# EasyEDA Pro project ProPrj_BackupProjects_ysingh2026_personal_0_20260314_2026-04-07.epro

# Schematic Bone conduction headphones
Board Name: Bone conduction headphones; Create Date: 2026-03-14; Page Name: Sheet_1; Project Name: BackupProjects_ysingh2026_personal_0_20260314; Schematic Name: Bone conduction headphones; Update Date: 2026-03-30; Add into BOM: yes; Company: Your Company; Convert to PCB: yes; Date: 2026-03-11; Draw By: ysingh2026; REV: 1.0; Sheet: 1/1; spicePre: .
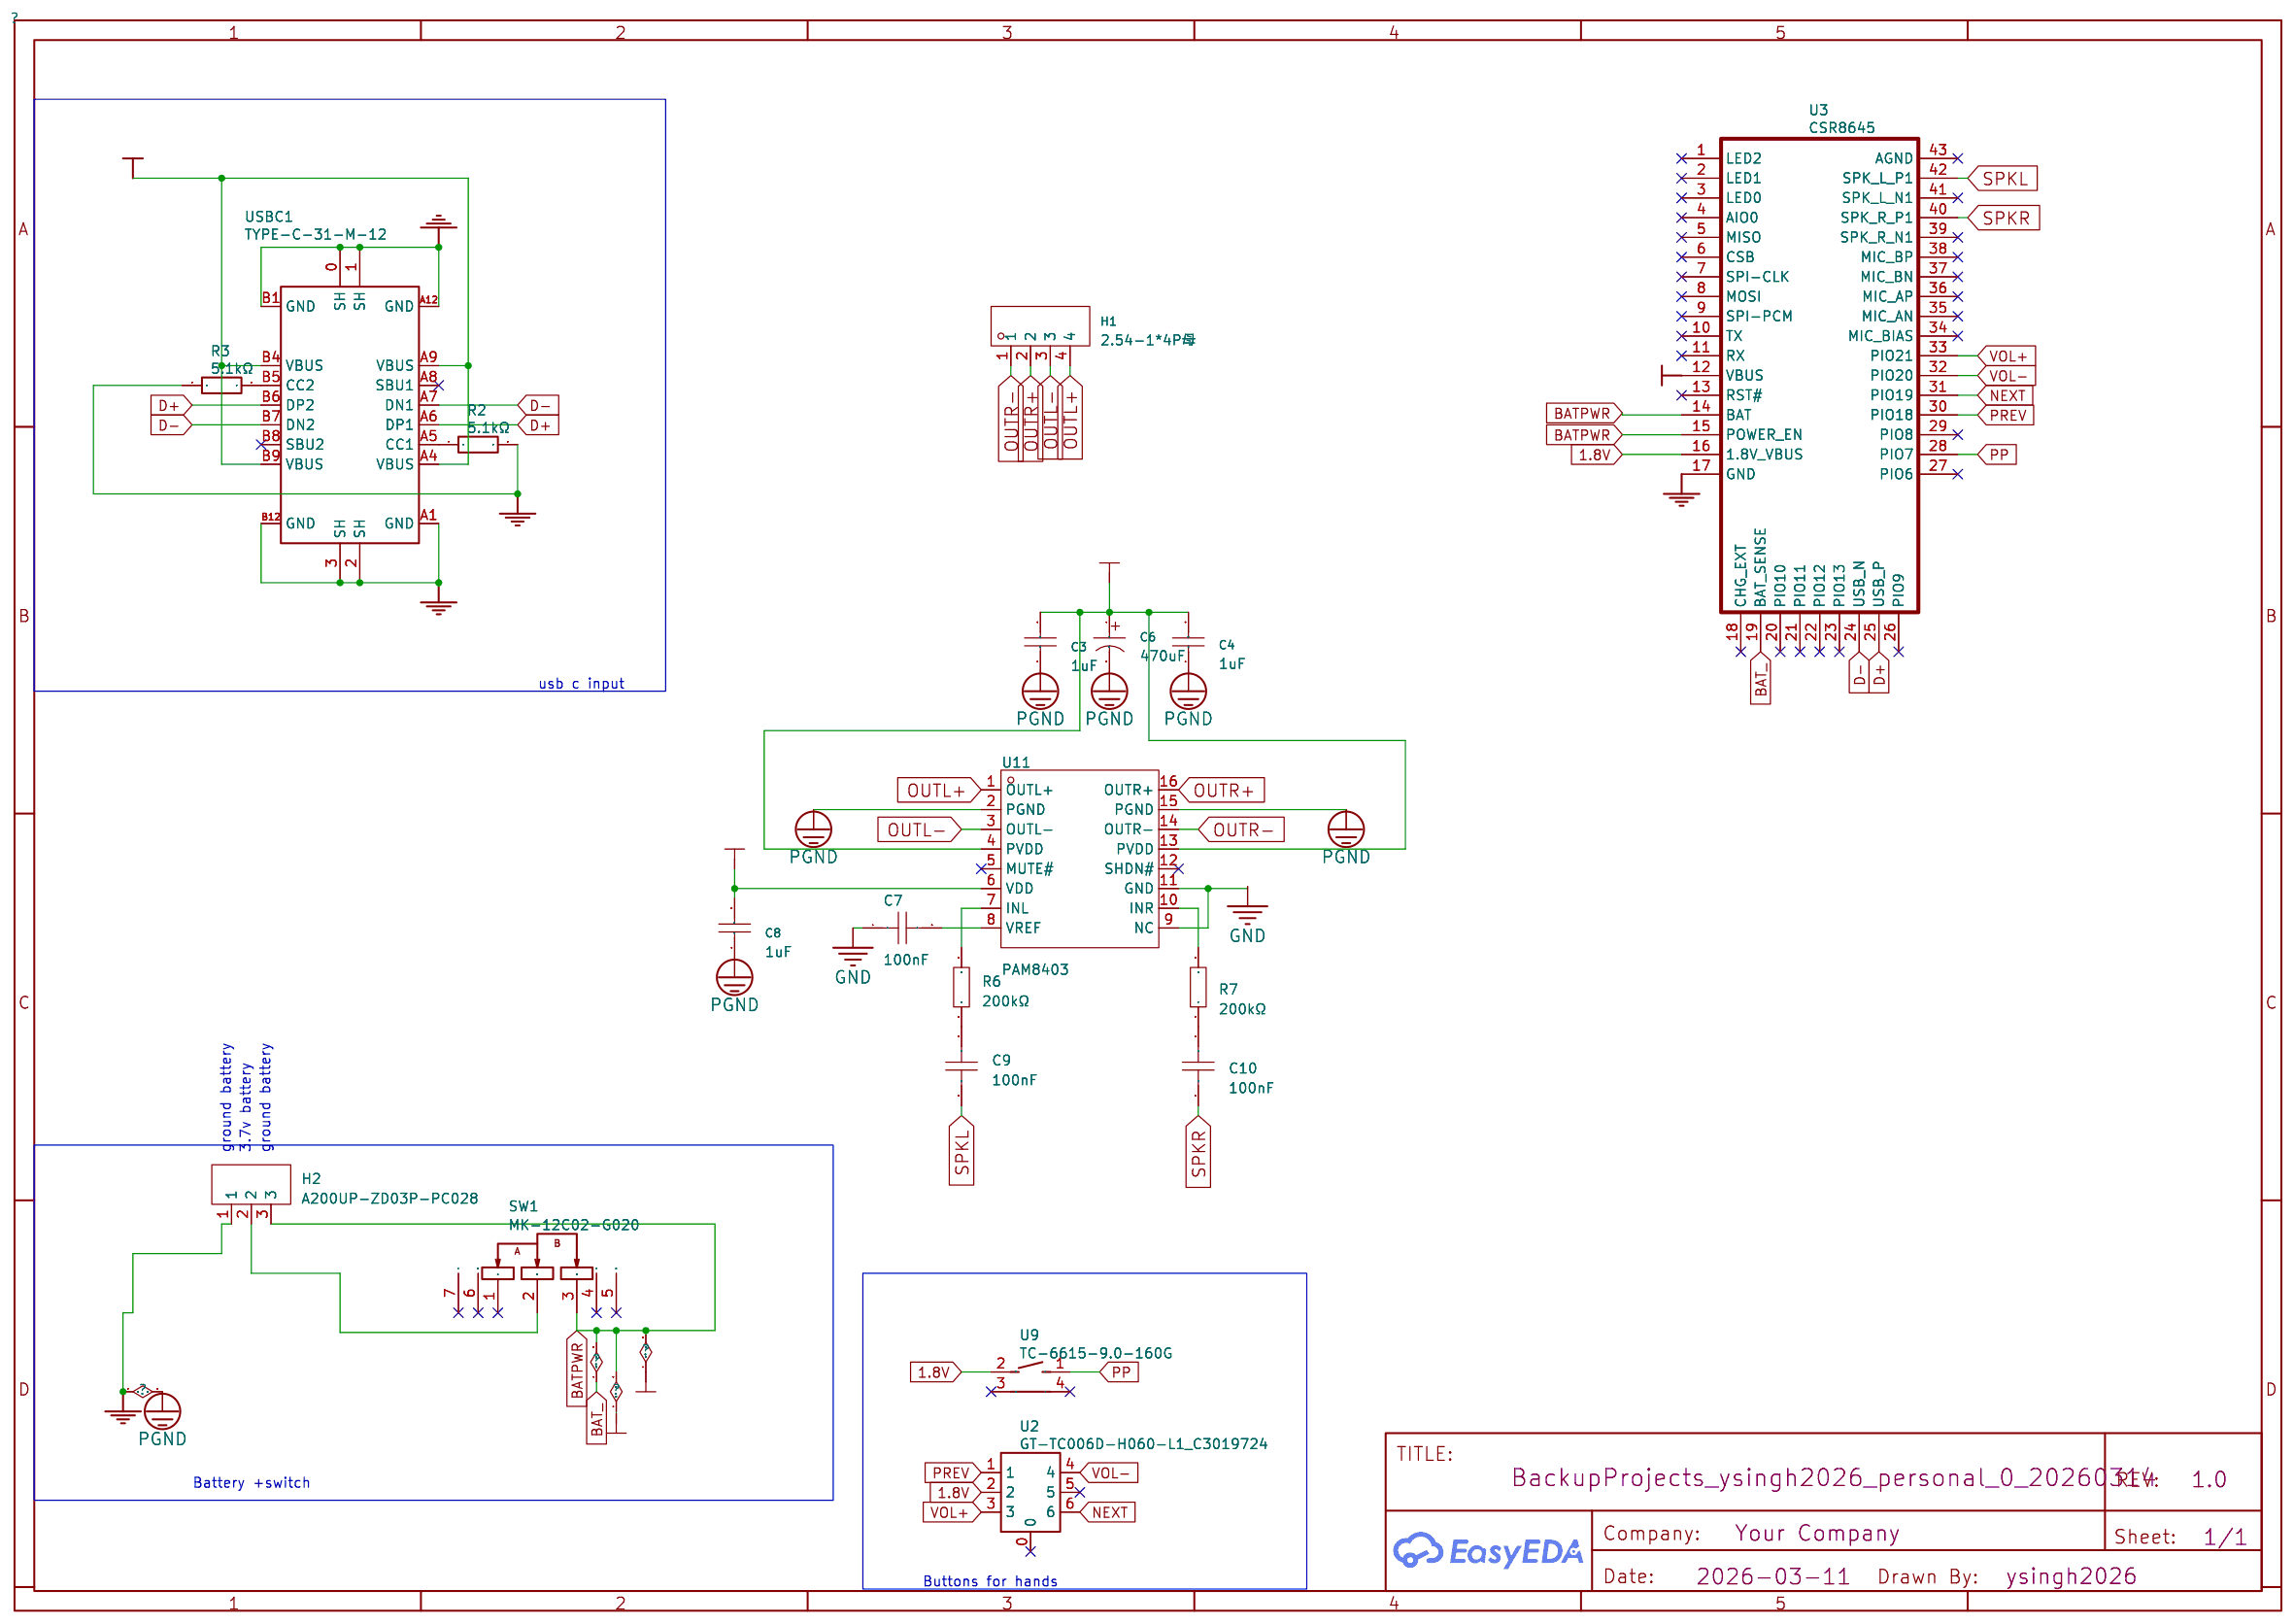
[diagram p0: schematic sheet]

## Parts
C3  1uF  [C0805]
C4  1uF  [C0805]
C6  470uF  [CAP-TH_BD10.0-P5.00-D1.0-FD]
C7  100nF  [C0603]
C8  1uF  [C0805]
C9  100nF  [C0603]
C10  100nF  [C0603]
H1  2.54-1*4P母  [HDR-TH_4P-P2.54-V-F]
H2  A200UP-ZD03P-PC028  [HDR-TH_A200UP-ZD03P-PC028]
R2  5.1kΩ  [R0402]
R3  5.1kΩ  [R0402]
R6  200kΩ  [R0603]
R7  200kΩ  [R0603]
SW1  MK-12C02-G020  [SW-SMD_MK-12C02-G020]
U2  GT-TC006D-H060-L1_C3019724  [SW-SMD-8_L7.5-W7.5-P1.40_GT-TC006D-H060-L1]
U3  CSR8645  [CSR8645]
U9  TC-6615-9.0-160G  [KEY-TH_PTS645VXX83XLFS]
U11  PAM8403  [SOP-16_L10.0-W3.9-P1.27-LS6.0-BL]
USBC1  TYPE-C-31-M-12  [USB-C_SMD-TYPE-C-31-M-12]

## Library data of the parts
C3 C4 C8 = CL21B105KBFNNNE: Capacitance:1uF Tolerance:±10% Tolerance:±10% Voltage Rating:50V Temperature Coefficient:X7R; LCSC Part Name: 1uF ±10% 50V; Supplier Part: C28323; Manufacturer: SAMSUNG(三星); Supplier Footprint: 0805; JLCPCB Part Class: Basic Part; Datasheet: https://item.szlcsc.com/datasheet/CL21B105KBFNNNE/29074.html; Supplier: LCSC; Tolerance: ±10%; Voltage Rating: 50V; Temperature Coefficient: X7R
C6 = 35YXJ470M10x16: Capacitance: Tolerance:±20% Tolerance:±20% Rated Voltage: Lead Spacing: φD: L: Lifetime @ Temp:10000hrs@105℃; LCSC Part Name: 470uF ±20% 35V; Supplier Part: C88732; Manufacturer: rubycon(红宝石); Supplier Footprint: 插件,D10xL16mm; JLCPCB Part Class: Extended Part; Datasheet: https://atta.szlcsc.com/upload/public/pdf/source/20190927/C432444_D90212164DBC1B856ABE912664018FD4.pdf; Supplier: LCSC; Tolerance: ±20%; Lifetime @ Temp: 10000hrs@105℃
C7 C9 C10 = CC0603KRX7R9BB104: Capacitance:100nF Tolerance:±10% Tolerance:±10% Voltage Rating:50V Temperature Coefficient:X7R; LCSC Part Name: 100nF ±10% 50V; Supplier Part: C14663; Manufacturer: YAGEO(国巨); Supplier Footprint: 0603; JLCPCB Part Class: Basic Part; Datasheet: https://item.szlcsc.com/datasheet/CC0603KRX7R9BB104/15331.html; Supplier: LCSC; Tolerance: ±10%; Voltage Rating: 50V; Temperature Coefficient: X7R
H1 = 2.54-1*4P母: Holes Structure:1x4P Pitch:2.54mm Row Spacing:- Circular Hole / Square Hole:Square Hole Mounting Type:Through Hole Number of Rows:1 Number of Positions:4P Current Rating:3A Voltage Rating (Max):- Holes Direction:Top Insulation Height:- Contact Material:Br; LCSC Part Name: 间距:2.54mm 1x4P 直插; Supplier Part: C2718488; Manufacturer: BOOMELE(博穆精密); Supplier Footprint: 插件,P=2.54mm; JLCPCB Part Class: Extended Part; Datasheet: https://item.szlcsc.com/datasheet/2.54-1*4P%25E6%25AF%258D/2834502.html; Supplier: LCSC; Holes Structure: 1x4P; Pitch: 2.54mm; Circular Hole / Square Hole: Square Hole; Mounting Type: Through Hole; Number of Rows: 1; Number of Positions: 4P; Current Rating: 3A; Holes Direction: Top; Contact Material: Bronze; Operating Temperature: -40℃~+105℃
H2 = A200UP-ZD03P-PC028: Pin Structure:1x3P Pitch:2mm Circluar Pins/Square Pins:Pin Header Mounting Type:Through Hole Number of Rows:1 Number of Pins:3P Current Rating:1.5A Length of Mating Pin:3.9mm Insulation Height:2mm Length of End Connection Pin:2.8mm Contact Material:Copper; LCSC Part Name: 1x3P 间距:2mm 方针 直插; Supplier Part: C49563331; Manufacturer: BXCONN(宝讯); Supplier Footprint: 插件,P=2mm; JLCPCB Part Class: Extended Part; Datasheet: https://item.szlcsc.com/datasheet/A200UP-ZD03P-PC028/52117272.html; Supplier: LCSC; Pin Structure: 1x3P; Pitch: 2mm; Circluar Pins/Square Pins: Pin Header; Mounting Type: Through Hole; Number of Rows: 1; Number of Pins: 3P; Current Rating: 1.5A; Length of Mating Pin: 3.9mm; Insulation Height: 2mm; Length of End Connection Pin: 2.8mm; Contact Material: Copper alloy; Operating Temperature: -40℃~+105℃
R2 R3 = 5.1kΩ: Supplier: LCSC; Manufacturer: YAGEO(国巨); Manufacturer Part: RC0402FR-075K1L; Supplier Part: C105872; JLCPCB Part Class: Extended Part; nameAlias: Value; spicePre: R; spiceSymbolName: RC0402FR-075K1L
R6 R7 = RC0603FR-07200KL: Type:Thick Film Resistors Resistance: Tolerance:±1% Tolerance:±1% Power(Watts): Overload Voltage (Max): Temperature Coefficient:±100ppm/℃ Temperature Coefficient:±100ppm/℃ Operating Temperature Range:-55℃~+155℃ Operating Temperature Range:-55℃~+155℃; LCSC Part Name: 厚膜电阻 200kΩ ±1% 100mW; Supplier Part: C105574; Manufacturer: YAGEO(国巨); Supplier Footprint: 0603; JLCPCB Part Class: Extended Part; Datasheet: https://atta.szlcsc.com/upload/public/pdf/source/20180821/C275644_0D56F95EFF785E7D9A1FEF436B37DA78.pdf; Supplier: LCSC; Type: Thick Film Resistors; Tolerance: ±1%; Temperature Coefficient: ±100ppm/℃; Operating Temperature Range: -55℃~+155℃
SW1 = MK-12C02-G020: Supplier: LCSC; Supplier Part: C963206; Manufacturer: G-Switch(品赞); JLCPCB Part Class: Extended Part; Contributor: LCSC; spicePre: S
U2 = GT-TC006D-H060-L1_C3019724: Supplier: LCSC; Supplier Part: C3019724; Manufacturer: G-Switch(品赞); Manufacturer Part: GT-TC006D-H060-L1; JLCPCB Part Class: Extended Part; Contributor: lcsc; spicePre: U
U3 = CSR8645: Supplier: EasyEDA; Contributor: kingcake; spicePre: U
U9 = TC-6615-9.0-160G: Supplier: LCSC; Supplier Part: C6575016; Manufacturer: HCTL(华灿天禄); JLCPCB Part Class: Extended Part; Contributor: lcsc; spicePre: U
U11 = PAM8403: Class:Class D Speaker Channels:2-Channel Output Power:3Wx2@4Ω Voltage - Supply:2.2V~5.5V Voltage - Supply:2.2V~5.5V Quiescent Current:6.3mA Operating Temperature:-40℃~+85℃ Operating Temperature:-40℃~+85℃ Efficiency:90%; LCSC Part Name: 3W无滤波器D类立体声音频功分器; Supplier Part: C5122557; Manufacturer: Slkor(萨科微); Supplier Footprint: SOP-16; JLCPCB Part Class: Extended Part; Datasheet: https://item.szlcsc.com/datasheet/PAM8403/5713463.html; Supplier: LCSC; Class: Class D; Speaker Channels: 2-Channel; Output Power: 3Wx2@4Ω; Voltage - Supply: 2.2V~5.5V; Quiescent Current: 6.3mA; Operating Temperature: -40℃~+85℃; Efficiency: 90%
USBC1 = TYPE-C-31-M-12: Supplier: LCSC; Supplier Part: C165948; Manufacturer: 韩国韩荣; JLCPCB Part Class: Extended Part; Contributor: LCSC; spicePre: U

## Nets
1.8V: U2.2 U3.16(1.8V VBUS) U9.2
+5V: U3.12(VBUS) USBC1.A4(VBUS) USBC1.A9(VBUS) USBC1.B4(VBUS) USBC1.B9(VBUS)
GND: C3.1 C4.1 C6.2 C7.1 C8.1 H2.1 R2.2 R3.1 U3.17(GND) U11.2(PGND) U11.9(NC) U11.11(GND) U11.15(PGND) USBC1.0(SH) USBC1.1(SH) USBC1.2(SH) USBC1.3(SH) USBC1.A1(GND) USBC1.A12(GND) USBC1.B1(GND) USBC1.B12(GND)
PVDD: C3.2 C4.2 C6.1 C8.2 H2.3 SW1.3 U3.14(BAT) U3.15(POWER_EN) U3.19(BAT_SENSE) U11.4(PVDD) U11.6(VDD) U11.13(PVDD)
D+: U3.25(USB_P) USBC1.A6(DP1) USBC1.B6(DP2)
D-: U3.24(USB_N) USBC1.A7(DN1) USBC1.B7(DN2)
NEXT: U2.6 U3.31(PIO19)
OUTL+: H1.4 U11.1(OUTL+)
OUTL-: H1.3 U11.3(OUTL-)
OUTR+: H1.2 U11.16(OUTR+)
OUTR-: H1.1 U11.14(OUTR-)
PP: U3.28(PIO7) U9.1
PREV: U2.1 U3.30(PIO18)
SPKL: C9.1 U3.42(SPK_L_P1)
SPKR: C10.1 U3.40(SPK_R_P1)
VOL+: U2.3 U3.33(PIO21)
VOL-: U2.4 U3.32(PIO20)
$1N1: H2.2 SW1.2
$1N416: R3.2 USBC1.B5(CC2)
$1N417: R2.1 USBC1.A5(CC1)
$1N3990: C7.2 U11.8(VREF)
$1N4311: C9.2 R6.1
$1N4313: C10.2 R7.1
$1N4317: R6.2 U11.7(INL)
$1N4322: R7.2 U11.10(INR)

Not connected (* = marked no-connect by the designer): SW1 1* 4* 5* 6* 7*; U2 0* 5*; U3 1(LED2)* 2(LED1)* 3(LED0)* 4(AIO0)* 5(MISO)* 6(CSB)* 7(SPI-CLK)* 8(MOSI)* 9(SPI-PCM)* 10(TX)* 11(RX)* 13(RST#)* 18(CHG_EXT)* 20(PIO10)* 21(PIO11)* 22(PIO12)* 23(PIO13)* 26(PIO9)* 27(PIO6)* 29(PIO8)* 34(MIC_BIAS)* 35(MIC_AN)* 36(MIC_AP)* 37(MIC_BN)* 38(MIC_BP)* 39(SPK_R_N1)* 41(SPK_L_N1)* 43(AGND)*; U9 3* 4*; U11 5(MUTE#)* 12(SHDN#)*; USBC1 A8(SBU1)* B8(SBU2)*

## Notes on the sheet
- usb c input
- ground battery
- 3.7v battery
- ground battery
- Battery +switch
- Buttons for hands

# Board 1-PCB_PCB_Bone conduction headphones_2
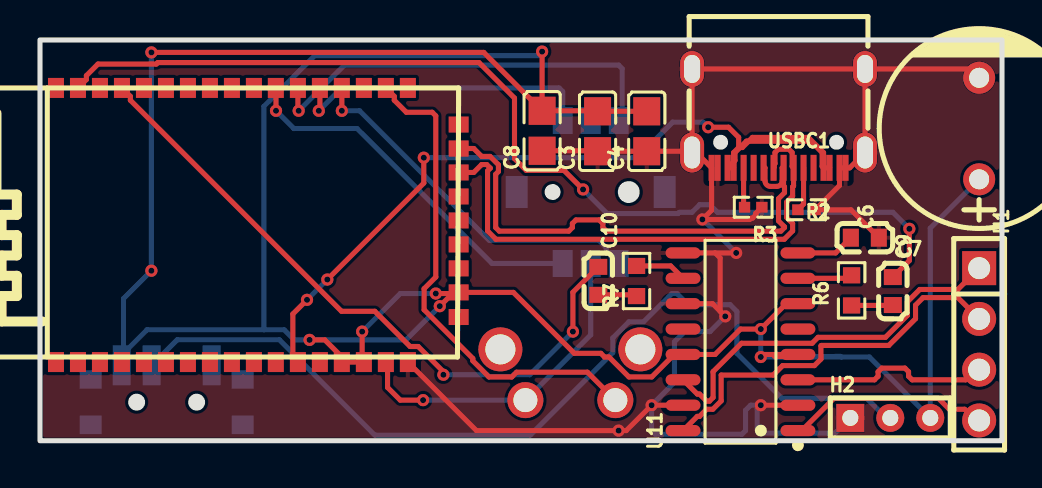
[diagram p1: board, top side]
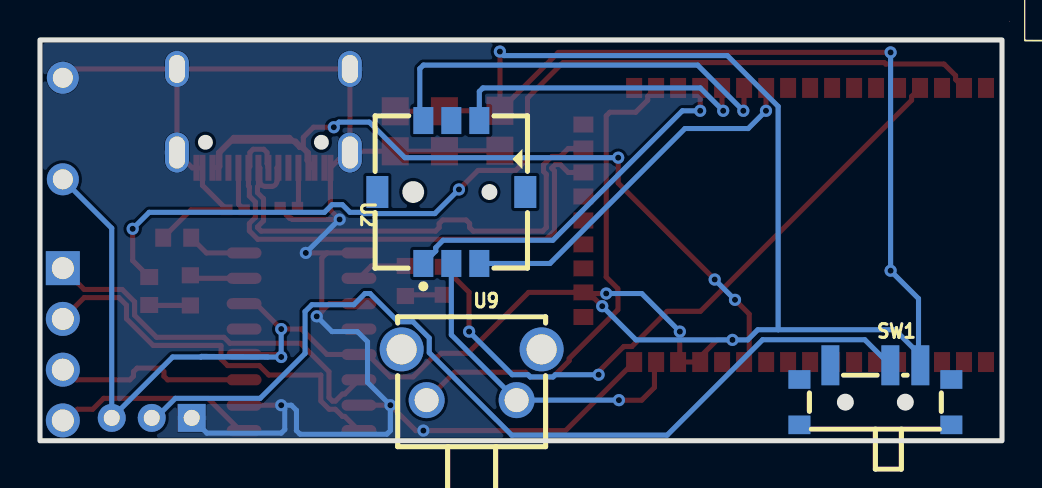
[diagram p2: board, bottom side, seen from below]

Outline 48.12 x 20.05 mm; copper layers: Top Layer, Bottom Layer. Coordinates in mm from the lower left corner of the outline.
Outline path: rectangle 0,20.05 48.12,0
Stack: Top Layer 0.035mm / Dielectric1 1.51mm FR4 er 4.5 / Bottom Layer 0.035mm

## Design rules (mm)
net D-: DP1
net D+: DP1
net OUTR+: DP3
net OUTR-: DP3
net OUTL-: DP2
net OUTL+: DP2
spacing Default (default): track to track 0.152, other pairs 0 to 0.152
track width Default (default): min 0.254, default 0.254, max 25.4
differential pair differentialPair (default): width min 0.127, default 0.254, max 2.54; gap min 0.152, default 0.152
via Default (default): diameter min 0.61, default 0.61, max 100.025; hole min 0.305, default 0.305, max 59.995

## Placement (name value [footprint] x y rotation side)
C3  1uF  [C0805]  27.89 15.49 90 top
C4  1uF  [C0805]  30.35 15.49 90 top
C6  470uF  [CAP-TH_BD10.0-P5.00-D1.0-FD]  46.97 15.62 90 top
C7  100nF  [C0603]  41.26 10.16 180 top
C8  1uF  [C0805]  25.12 15.51 90 top
C9  100nF  [C0603]  42.66 7.49 270 top
C10  100nF  [C0603]  27.93 8 270 top
H1  2.54-1*4P母  [HDR-TH_4P-P2.54-V-F]  46.97 4.83 270 top
H2  A200UP-ZD03P-PC028  [HDR-TH_A200UP-ZD03P-PC028]  42.53 1.14 0 top
R2  5.1kΩ  [R0402]  38.34 11.56 0 top
R3  5.1kΩ  [R0402]  35.67 11.68 180 top
R6  200kΩ  [R0603]  40.59 7.52 90 top
R7  200kΩ  [R0603]  29.84 7.99 90 top
SW1  MK-12C02-G020  [SW-SMD_MK-12C02-G020]  6.34 2.29 180 bottom
U2  GT-TC006D-H060-L1_C3019724  [SW-SMD-8_L7.5-W7.5-P1.40_GT-TC006D-H060-L1]  27.54 12.45 90 bottom
U3  -  [CSR8645]  20.94 6.22 90 top
U9  TC-6615-9.0-160G  [KEY-TH_PTS645VXX83XLFS]  26.53 3.3 180 bottom
U11  PAM8403  [SOP-16_L10.0-W3.9-P1.27-LS6.0-BL]  35.04 4.95 90 top
USBC1  TYPE-C-31-M-12  [USB-C_SMD-TYPE-C-31-M-12]  36.94 16.13 180 top

## Footprints (pads in the part's own frame, mm; a bottom-side part is the same pattern mirrored in y, then rotated)
C0603
  rect 0.8x0.9 smd: 1(-0.7,0) 2(0.7,0)
C0805
  rect 1.41x1.35 smd: 1(-1,0) 2(1,0)
CAP-TH_BD10.0-P5.00-D1.0-FD
  round 1.6 hole 1: 1(-2.54,0) 2(2.54,0)
CSR8645
  rect 1x0.8 smd: 1(-2.285,20.14) 2(-2.285,19.04) 3(-2.285,17.94) 4(-2.285,16.84) 5(-2.285,15.74) 6(-2.285,14.64) 7(-2.285,13.54) 8(-2.285,12.44) 9(-2.285,11.34) 10(-2.285,10.24) 11(-2.285,9.144) 12(-2.285,8.04) 13(-2.285,6.94) 14(-2.285,5.842) 15(-2.285,4.74) 16(-2.285,3.64) 17(-2.285,2.54) 27(11.431,2.54) 28(11.431,3.64) 29(11.431,4.74) 30(11.431,5.842) 31(11.431,6.94) 32(11.431,8.04) 33(11.431,9.144) 34(11.431,10.24) 35(11.431,11.34) 36(11.431,12.44) 37(11.431,13.54) 38(11.431,14.64) 39(11.431,15.74) 40(11.431,16.84) 41(11.431,17.94) 42(11.431,19.04) 43(11.431,20.14)
  rect 0.8x1 smd: 18(-0.032,-0.001) 19(1.2,-0.001) 20(2.4,-0.001) 21(3.6,-0.001) 22(4.8,-0.001) 23(6,-0.001) 24(7.2,-0.001) 25(8.4,-0.001) 26(9.6,-0.001)
HDR-TH_4P-P2.54-V-F
  rect 1.7x1.7 hole 1.1: 1(-3.81,0)
  round 1.7 hole 1.1: 2(-1.27,0) 3(1.27,0) 4(3.81,0)
HDR-TH_A200UP-ZD03P-PC028
  rect 1.4x1.4 hole 0.8: 1(-2,0)
  round 1.4 hole 0.8: 2(0,0) 3(2,0)
KEY-TH_PTS645VXX83XLFS
  round 1.8 hole 1.2: 1(-2.25,-1.27) 2(2.25,-1.27)
  round 2.2 hole 1.5: 3(-3.5,1.27) 4(3.5,1.27)
R0402
  rect 0.566x0.54 smd: 1(-0.433,0) 2(0.433,0)
R0603
  rect 0.806x0.864 smd: 1(-0.753,0) 2(0.753,0)
SOP-16_L10.0-W3.9-P1.27-LS6.0-BL
  oval 0.56x1.745 smd: 1(-4.445,-2.873) 2(-3.175,-2.873) 3(-1.905,-2.873) 4(-0.635,-2.873) 5(0.635,-2.873) 6(1.905,-2.873) 7(3.175,-2.873) 8(4.445,-2.873) 9(4.445,2.873) 10(3.175,2.873) 11(1.905,2.873) 12(0.635,2.873) 13(-0.635,2.873) 14(-1.905,2.873) 15(-3.175,2.873) 16(-4.445,2.873)
SW-SMD-8_L7.5-W7.5-P1.40_GT-TC006D-H060-L1
  rect 1.6x1.1 smd: 0(0,-3.7) 0(0,3.7)
  rect 1.35x1 smd: 1(-3.575,1.4) 2(-3.575,0) 3(-3.575,-1.4) 4(3.575,1.4) 5(3.575,0) 6(3.575,-1.4)
SW-SMD_MK-12C02-G020
  rect 0.9x2 smd: 1(-2.25,1.49) 2(0.75,1.49) 3(2.25,1.49)
  rect 1.1x0.93 smd: 4(3.8,0.779) 5(3.8,-1.49) 6(-3.8,-1.49) 7(-3.8,0.779)
USB-C_SMD-TYPE-C-31-M-12
  oval 1.2x2 hole 0.8x1.6: 0(-4.325,1.706) 1(4.325,1.706)
  oval 1.2x1.8 hole 0.8x1.4: 2(4.325,-2.474) 3(-4.325,-2.474)
  rect 0.3x1.3 smd: A1(-3.35,2.474) A4(-2.55,2.474) A5(-1.25,2.474) A6(-0.25,2.474) A7(0.25,2.474) A8(1.25,2.474) A9(2.55,2.474) A12(3.35,2.474) B1(3.05,2.474) B4(2.25,2.474) B5(1.75,2.474) B6(0.75,2.474) B7(-0.75,2.474) B8(-1.75,2.474) B9(-2.25,2.474) B12(-3.05,2.474)

## Nets
As in the schematic.

Pads without a net: SW1 1 4 5 6 7; U2 0 5; U3 1 2 3 4 5 6 7 8 9 10 11 13 18 20 21 22 23 26 27 29 34 35 36 37 38 39 41 43; U9 3 4; U11 5 12; USBC1 A8 B8

## Via types
v1: diameter 0.61, hole 0.305, Top Layer to Bottom Layer, 28 vias

## Routing (per net, layer and track width the routed paths; a pad name or vN(x,y) marks a point on that pad's centre or on a via; arc(x,y) is an arc through that point)
1.8V: length 16.7
  Top Layer w0.254: U3.16 17.38,3.85 17.38,2.67 18.02,2.03 v1(19.16,2.03)
  Bottom Layer w0.254: 27.54,8.89 27.54,5.3 U9.2 v1(19.16,2.03)
+5V: length 44.2
  Top Layer w0.254: USBC1.B9 39.12,13.73 39.12,14.42 38.55,14.99 35.45,14.99 ; USBC1.B9 39.19,14.42 38.43,15.18 35.64,15.18 35.45,14.99 ; USBC1.B9 USBC1.A4 ; 35.01,14.67 35.33,14.99 35.45,14.99 ; 35.01,14.67 34.95,14.67 ; 35.01,14.67 35.13,14.67 35.45,14.99 ; 35.01,14.67 34.76,14.42 34.76,14.03 34.69,13.95 ; 34.69,13.95 USBC1.B4 USBC1.A9 34.69,13.95 ; 34.69,13.95 34.69,14.42 34.95,14.67 ; 34.95,14.67 34.95,15.18 34.44,15.69 v1(33.42,15.69) ; v1(14.37,8.07) 19.2,12.89 v1(19.2,14.16) ; U3.12 12.65,4.19 12.65,6.34 v1(13.36,7.05)
  Bottom Layer w0.254: v1(14.37,8.07) v1(13.36,7.05) ; v1(33.42,15.69) 33.17,15.94 31.64,15.94 29.87,14.16 v1(19.2,14.16)
GND: length 94.8
  Top Layer w0.254: C6.2 46.53,18.6 USBC1.3 ; R3.1 35.8,11.38 35.8,11.3 35.64,11.14 35.56,11.14 35.49,11.07 v1(33.13,11.07) 33.59,11.53 USBC1.A12 32.82,14.42 32.62,14.42 ; v1(34.82,9.4) 33.77,9.4 ; 33.77,9.4 34.02,9.14 34.02,6.48 ; 33.77,9.4 U11.9 ; USBC1.3 USBC1.0 40.5,13.66 USBC1.A1 USBC1.B12 39.99,12.78 R2.2 40.56,11.56 C7.1 ; USBC1.3 32.62,18.6 32.62,14.42 ; U3.17 21.83,0.51 v1(28.94,0.51) 29.32,0.51 v1(30.59,1.78) U11.15 ; 32.62,14.42 32.55,14.49 C4.1 C3.1 27.87,14.51 C8.1 ; U11.11 33.64,6.86 34.02,6.48 ; 34.02,6.48 v1(34.28,6.22) ; v1(36.05,1.78) U11.2
  Bottom Layer w0.254: v1(34.82,9.4) 33.15,11.07 v1(33.13,11.07) ; H2.1 39.77,0.38 36.05,0.38 35.87,0.56 35.87,1.6 v1(36.05,1.78) 35.54,1.78 35.29,1.52 35.29,0.51 35.11,0.33 30.77,0.33 30.59,0.51 v1(30.59,1.78) 31.74,2.92 31.74,4.95 32.24,5.46 33.51,5.46 v1(34.28,6.22)
PVDD: length 152.4
  Top Layer w0.254: v1(25.12,19.47) C8.2 ; C8.2 22.19,19.43 v1(5.57,19.43) ; C8.2 27.87,16.51 C3.2 C4.2 ; 36.74,4.22 37.81,4.22 U11.4 36.18,4.32 v1(36.05,4.19) ; 31.68,4.19 31.81,4.32 U11.13 ; 31.68,4.19 32.04,4.19 U11.13 ; 31.68,4.19 31.6,4.19 30.6,3.19 29.46,3.19 28.46,4.19 28.24,4.19 28.05,4.38 26.72,4.38 23.68,7.42 U3.19 ; v1(13.48,5.05) 14.25,5.05 15.01,4.28 15.01,4.03 U3.14 U3.15 16.11,4.02 v1(16.11,5.46) ; v1(20,6.73) 20.63,7.37 ; 20.63,7.37 20.88,7.37 U3.19 ; 20.63,7.37 v1(19.8,7.37) ; 20.63,7.37 20.69,7.42 U3.19 ; U11.13 33.77,4.32 35.04,5.59 v1(36.05,5.59) 37.32,6.86 U11.6
  Bottom Layer w0.254: 36.74,4.19 40.07,4.19 ; 36.74,4.19 v1(36.05,4.19) v1(36.05,5.59) ; 36.74,4.19 40.04,4.22 40.07,4.19 ; 40.07,4.19 41.48,4.19 H2.3 44.53,10.64 46.97,13.08 ; 4.18,4.38 4.09,4.28 SW1.3 4.18,3.87 4.18,4.38 ; 4.18,4.38 4.18,7.11 v1(5.57,8.51) v1(5.57,19.43) ; 4.18,4.38 5.35,5.55 11.2,5.55 ; v1(16.11,5.46) 18.02,7.37 v1(19.8,7.37) ; 11.2,5.55 11.2,16.73 13.74,19.27 24.91,19.27 v1(25.12,19.47) ; 11.2,5.55 12.21,5.55 12.72,5.05 v1(13.48,5.05) 18.31,5.05 v1(20,6.73)
D+: length 26.7
  Top Layer w0.254: USBC1.B6 36.26,13.66 36.26,13 arc(36.34,12.81) 36.54,12.73 36.84,12.73 arc(37.04,12.81) 37.12,13 37.12,13.66 USBC1.A6 37.19,12.75 37.24,12.7 37.24,12.41 36.94,12.11 36.94,11 37.24,10.7 37.24,10.67 37.06,10.49 28.33,10.49 28.15,10.67 28.15,10.87 27.97,11.05 26.81,11.05 26.63,10.87 26.63,10.67 26.45,10.49 22.97,10.49 22.79,10.67 22.79,13.33 22.93,13.47 22.93,13.81 22.51,14.23 22.09,14.23 21.69,14.62 U3.25
D-: length 26.6
  Top Layer w0.254: USBC1.A7 36.71,13.68 36.71,13.82 36.76,13.87 36.76,14.42 36.93,14.58 37.46,14.58 37.62,14.42 37.62,13.73 USBC1.B7 37.69,12.75 37.65,12.7 37.65,12.24 37.34,11.94 37.34,11.17 37.65,10.87 37.65,10.5 37.23,10.08 22.8,10.08 22.39,10.5 22.39,13.5 22.52,13.64 22.34,13.82 22.09,13.82 21.69,13.42 U3.24
NEXT: length 15.4
  Top Layer w0.254: v1(13.95,16.51) 14,16.56 U3.31
  Bottom Layer w0.254: v1(13.95,16.51) 15.09,17.65 25.96,17.65 26.14,17.47 U2.6
OUTL+: length 10.2
  Top Layer w0.254: H1.4 46.81,1.02 46.25,1.58 45.48,1.58 44.94,2.12 39.71,2.12 38.1,0.51 U11.1
OUTL-: length 10
  Top Layer w0.254: U11.3 41.74,3.05 41.92,3.23 41.92,3.45 42.1,3.63 43.26,3.63 43.44,3.45 43.44,3.23 43.62,3.05 46.3,3.05 46.81,3.56 H1.3
OUTR+: length 19.5
  Top Layer w0.254: H1.2 45.91,7.16 44.17,7.16 43.79,6.78 43.79,6.11 42.46,4.77 39.08,4.77 39.06,4.75 39.06,4.09 38.73,3.76 37.15,3.76 36.67,3.29 34.07,3.29 34.07,1.99 33.65,1.58 33.34,1.58 32.99,1.22 32.88,1.22 U11.16
OUTR-: length 19.2
  Top Layer w0.254: U11.14 32.88,2.34 32.99,2.34 33.34,1.98 33.49,1.98 33.66,2.16 33.66,3.45 35.09,4.88 38.62,4.88 38.92,5.18 42.29,5.18 43.39,6.27 43.39,6.95 44,7.57 45.91,7.57 H1.1
PP: length 24.8
  Top Layer w0.254: U3.28 17.72,17.23 17.72,17.04 18.32,16.44 19.62,16.44 19.8,16.26 19.8,8.19 19.21,7.61 19.21,6.55 21.65,4.12 21.65,4 22.46,3.19 23.6,3.19 23.84,3.43 27.38,3.43 U9.1
PREV: length 18.3
  Top Layer w0.254: U3.30 v1(15.1,16.51)
  Bottom Layer w0.254: U2.1 28.32,9.49 28.32,9.66 27.95,10.03 22.46,10.03 15.99,16.51 v1(15.1,16.51)
SPKL: length 50.6
  Top Layer w0.254: U3.42 2.32,18.07 2.32,18.27 2.9,18.85 5.81,18.85 5.89,18.92 21.96,18.92 23.73,17.14 23.73,14.12 24.32,13.53 26.21,13.53 v1(27.16,12.57) ; C9.1 43.48,9.02 v1(43.48,10.6)
  Bottom Layer w0.254: v1(43.48,10.6) 42.66,11.43 33.89,11.43 33.51,11.81 32.99,11.81 32.61,11.43 31.97,11.43 31.91,11.37 28.37,11.37 v1(27.16,12.57)
SPKR: length 33.5
  Top Layer w0.254: U3.40 4.52,17.23 4.52,17.04 15.08,6.48 16.75,6.48 18.51,4.72 18.92,4.72 20.18,3.45 v1(20.18,3.3) ; v1(26.66,5.46) 26.66,7.43 C10.1
  Bottom Layer w0.254: v1(26.66,5.46) 24.5,3.3 23.71,3.3 23.6,3.19 22.46,3.19 22.35,3.3 v1(20.18,3.3)
VOL+: length 18.7
  Top Layer w0.254: U3.33 11.81,17.64 v1(11.81,16.51)
  Bottom Layer w0.254: U2.3 22.61,8.87 15.86,15.62 12.69,15.62 v1(11.81,16.51)
VOL-: length 21
  Top Layer w0.254: v1(12.94,16.51) 12.9,16.55 U3.32
  Bottom Layer w0.254: v1(12.94,16.51) 15.22,18.8 28.94,18.8 29.12,18.62 29.12,16.2 U2.4
$1N1: length 46.6
  Bottom Layer w0.254: H2.2 42.32,1.14 41.35,2.12 37.11,2.12 34.86,4.37 34.86,6.47 34.52,6.81 32.42,6.81 31.86,7.37 31.61,7.37 30.19,5.95 29.46,5.95 28.65,5.14 28.65,4.41 24.52,0.28 16.75,0.28 11.97,5.06 6.86,5.06 SW1.2
$1N416: length 2
  Top Layer w0.254: USBC1.B5 35.19,11.73 R3.2
$1N417: length 2.2
  Top Layer w0.254: R2.1 38.19,11.84 USBC1.A5
$1N3990: length 3
  Top Layer w0.254: 40.56,10.16 39.79,9.4 U11.8
$1N4311: length 2.1
  Top Layer w0.254: C9.2 42.64,6.77 R6.1
$1N4313: length 1.9
  Top Layer w0.254: R7.1 29.78,7.3 C10.2
$1N4317: length 2.7
  Top Layer w0.254: R6.2 40.45,8.13 U11.7
$1N4322: length 2.6
  Top Layer w0.254: U11.10 31.55,8.75 R7.2

## Copper pours and planes (outline as drawn; the poured copper is in the pictures)
GND on Top Layer: -5.35,23.62 53.58,23.62 53.58,-4.32 -5.35,-4.32
GND on Bottom Layer: -5.35,23.62 53.58,23.62 53.58,-4.19 -5.35,-4.19
